# Altium schematic sheet Power_MCU.SchDoc
size A4; DocumentNumber: 3; SheetNumber: 3; SheetTotal: 8
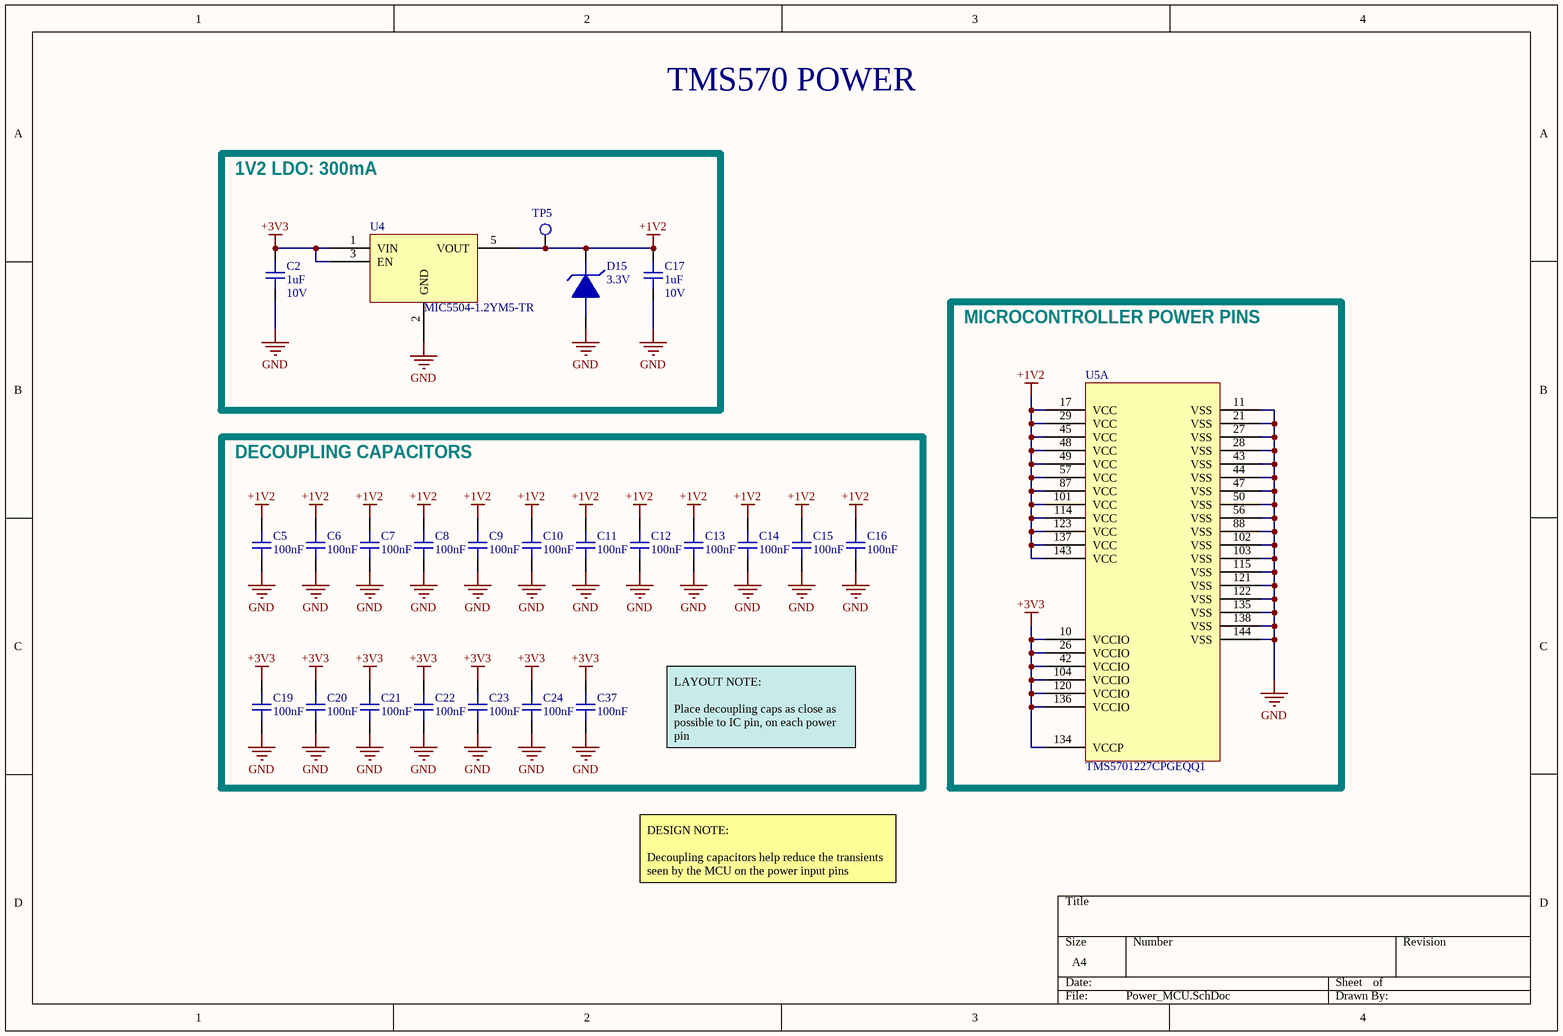
[diagram p0: Power_MCU.SchDoc]

## Parts
C2  1uF  Voltage Rating: 10V  [C0402]
C5  100nF  [C0402]
C6  100nF  [C0402]
C7  100nF  [C0402]
C8  100nF  [C0402]
C9  100nF  [C0402]
C10  100nF  [C0402]
C11  100nF  [C0402]
C12  100nF  [C0402]
C13  100nF  [C0402]
C14  100nF  [C0402]
C15  100nF  [C0402]
C16  100nF  [C0402]
C17  1uF  Voltage Rating: 10V  [C0402]
C19  100nF  [C0402]
C20  100nF  [C0402]
C21  100nF  [C0402]
C22  100nF  [C0402]
C23  100nF  [C0402]
C24  100nF  [C0402]
C37  100nF  [C0402]
D15  3.3V  [DIODE_TVS]
TP5  5015  [TP_HOOK]  (value not drawn)
U4  MIC5504-1.2YM5-TR  [SOT23-5-MIC5504]
U5  TMS5701227CPGEQQ1  [LQFP-144]  (part A of 3)

## Blocks framed on the sheet
1V2 LDO: 300mA: C2 C17 D15 TP5 U4
MICROCONTROLLER POWER PINS: U5
DECOUPLING CAPACITORS: C5-C16 C19-C24 C37

## Nets
+1V2: C5.2 C6.2 C7.2 C8.2 C9.2 C10.2 C11.2 C12.2 C13.2 C14.2 C15.2 C16.2 C17.2 D15.1 TP5.1 U4.5(VOUT) U5.17(VCC) U5.29(VCC) U5.45(VCC) U5.48(VCC) U5.49(VCC) U5.57(VCC) U5.87(VCC) U5.101(VCC) U5.114(VCC) U5.123(VCC) U5.137(VCC) U5.143(VCC)
+3V3: C2.2 C19.2 C20.2 C21.2 C22.2 C23.2 C24.2 C37.2 U4.1(VIN) U4.3(EN) U5.10(VCCIO) U5.26(VCCIO) U5.42(VCCIO) U5.104(VCCIO) U5.120(VCCIO) U5.134(VCCP) U5.136(VCCIO)
GND: C2.1 C5.1 C6.1 C7.1 C8.1 C9.1 C10.1 C11.1 C12.1 C13.1 C14.1 C15.1 C16.1 C17.1 C19.1 C20.1 C21.1 C22.1 C23.1 C24.1 C37.1 D15.2 U4.2(GND) U5.11(VSS) U5.21(VSS) U5.27(VSS) U5.28(VSS) U5.43(VSS) U5.44(VSS) U5.47(VSS) U5.50(VSS) U5.56(VSS) U5.88(VSS) U5.102(VSS) U5.103(VSS) U5.115(VSS) U5.121(VSS) U5.122(VSS) U5.135(VSS) U5.138(VSS) U5.144(VSS)

## Notes on the sheet
- TMS570 POWER
- LAYOUT NOTE:
  Place decoupling caps as close as possible to IC pin, on each power pin
- DESIGN NOTE:
  Decoupling capacitors help reduce the transients seen by the MCU on the power input pins

## Library data of the parts
C2 C17 = CL05A105MP5NNNC: CAP MLCC 1uF 10V 0402 X5R 20% SMD 0402 85C Paper T/R; Manufacturer: Samsung; Supplier 1: Digi-Key; Manufacturer Part Number: CL05A105MP5NNNC; Stock 1: 100000; Pricing 1: 1=0.1, 10=0.031, 100=0.014, 500=0.01, 1000=0.0079, 2500=0.0072, 5000=0.0066 (USD); Mount: Surface Mount; Case/Package: 0402; Case Code (Metric): 1005; Case Code (Imperial): 0402; Min Operating Temperature: -55°C; Max Operating Temperature: 85°C; Package Quantity: 1; Packaging: Tape and Reel; Capacitance: 1uF; Tolerance: 20%; Dielectric: X5R; Voltage Rating (DC): 10V; Length: 1mm; Height: 0.5mm; Width: 0.02inch; Thickness: 0.022inch; Depth: 0.5mm; Radiation Hardening: No; Lead Free: Lead Free; ComponentLink1URL: https://media.digikey.com/pdf/Data%20Sheets/Samsung%20PDFs/CL_Series_MLCC_ds.pdf; ComponentLink1Description: https://media.digikey.com/pdf/Data%20Sheets/Samsung%20PDFs/CL_Series_MLCC_ds.pdf; Supplier Part Number 1: 1276-1448-1-ND
C5-C16 C19-C24 C37 = CL05A104MP5NNNC: CAP MLCC 0.1uF 10V X5R 0402 20% SMD 0402 85C Paper T/R; Manufacturer: Samsung; Supplier 1: Digi-Key; Manufacturer Part Number: CL05A104MP5NNNC; Stock 1: 100000; Pricing 1: 1=0.1, 10=0.024, 100=0.0106, 500=0.0076, 1000=0.006, 2500=0.0054, 5000=0.005 (USD); Mount: Surface Mount; Case/Package: 0402; Case Code (Metric): 1005; Case Code (Imperial): 0402; Min Operating Temperature: -55°C; Max Operating Temperature: 85°C; Packaging: Tape and Reel; Capacitance: 100nF; Tolerance: 20%; Voltage Rating: 10V; Dielectric: X5R; Voltage Rating (DC): 10V; Length: 1mm; Height: 0.5mm; Width: 0.02inch; Thickness: 0.022inch; Depth: 0.5mm; Radiation Hardening: No; Lead Free: Lead Free; ComponentLink1URL: https://media.digikey.com/pdf/Data%20Sheets/Samsung%20PDFs/CL_Series_MLCC_ds.pdf; ComponentLink1Description: https://media.digikey.com/pdf/Data%20Sheets/Samsung%20PDFs/CL_Series_MLCC_ds.pdf; Supplier Part Number 1: 1276-1443-1-ND
D15 = 1SMA5913BT3G: DIODE ZENER 3.3V 1.5W SMA; Manufacturer: ON Semiconductor; Material: Plastic; Forward Voltage: 1.5V; Tolerance: 5%; Impedance: 10R; Max Reverse Leakage Current: 50uA; Power Dissipation: 500mW; Zener Current: 455mA; Test Current: 113.6mA; Element Configuration: Single; Breakdown Voltage: 3.47V; Supplier 1: Digi-Key; Manufacturer Part Number: 1SMA5913BT3G; Stock 1: 12228; Pricing 1: 1=0.38, 10=0.305, 100=0.2076, 500=0.1557, 1000=0.1168 (USD); Case/Package: SMA; Number of Pins: 2; Min Operating Temperature: -65°C; Max Operating Temperature: 150°C; Max Power Dissipation: 1.5W; Package Quantity: 1; Packaging: Tape and Reel; Zener Voltage: 3.3V; Voltage Tolerance: 5%; Working Voltage: 3.3V; Peak Reverse Current: 50uA; Voltage Rating (DC): 3.3V; Power Rating: 1.5W; Length: 4.57mm; Height: 2.05mm; Width: 2.92mm; Radiation Hardening: No; REACH SVHC: No SVHC; Lead Free: Lead Free; Halogen Free: Halogen Free; ComponentLink1URL: https://datasheet.ciiva.com/8026/1sma5913bt3-d-8026917.pdf; ComponentLink1Description: https://datasheet.ciiva.com/8026/1sma5913bt3-d-8026917.pdf; ComponentLink2URL: https://datasheet.ciiva.com/8345/1sma5913bt3-d-8345864.pdf; ComponentLink2Description: https://datasheet.ciiva.com/8345/1sma5913bt3-d-8345864.pdf; ComponentLink3URL: https://datasheet.ciiva.com/8346/1sma5913bt3-d-8346488.pdf; ComponentLink3Description: https://datasheet.ciiva.com/8346/1sma5913bt3-d-8346488.pdf; ComponentLink4URL: https://datasheet.ciiva.com/895/1sma5913bt3-d-895306.pdf; ComponentLink4Description: https://datasheet.ciiva.com/895/1sma5913bt3-d-895306.pdf; ComponentLink5URL: https://datasheet.ciiva.com/15142/getdatasheetpartid-90498-15142554.pdf; ComponentLink5Description: https://datasheet.ciiva.com/15142/getdatasheetpartid-90498-15142554.pdf; ComponentLink6URL: https://datasheet.ciiva.com/895/1sma5913bt3-d-895307.pdf; ComponentLink6Description: https://datasheet.ciiva.com/895/1sma5913bt3-d-895307.pdf; ComponentLink7URL: https://datasheet.ciiva.com/4733/1sma5913bt3-d-4733195.pdf; ComponentLink7Description: https://datasheet.ciiva.com/4733/1sma5913bt3-d-4733195.pdf; ComponentLink8URL: https://datasheet.ciiva.com/895/1sma5913bt3-d-895308.pdf; ComponentLink8Description: https://datasheet.ciiva.com/895/1sma5913bt3-d-895308.pdf; ComponentLink9URL: https://datasheet.ciiva.com/16472/1sma5913bt3-d-16472764.pdf; ComponentLink9Description: https://datasheet.ciiva.com/16472/1sma5913bt3-d-16472764.pdf; ComponentLink10URL: https://datasheet.ciiva.com/49027/70339279-49027772.pdf; ComponentLink10Description: https://datasheet.ciiva.com/49027/70339279-49027772.pdf; ComponentLink11URL: https://datasheet.ciiva.com/8026/1sma5913bt3-d-8026989.pdf; ComponentLink11Description: https://datasheet.ciiva.com/8026/1sma5913bt3-d-8026989.pdf; ComponentLink12URL: https://datasheet.ciiva.com/8026/1sma5913bt3-d-8026990.pdf; ComponentLink12Description: https://datasheet.ciiva.com/8026/1sma5913bt3-d-8026990.pdf; ComponentLink13URL: https://datasheet.ciiva.com/26092/1sma5913bt3-d-26092398.pdf; ComponentLink13Description: https://datasheet.ciiva.com/26092/1sma5913bt3-d-26092398.pdf; Supplier Part Number 1: 1SMA5913BT3GOSCT-ND
TP5 = 5015: TEST POINT, PCB, SMT; Manufacturer: Keystone Electronics; Number of Ports: 1; Supplier 1: Digi-Key; Manufacturer Part Number: 5015; Stock 1: 1937775; Pricing 1: 1=0.44, 10=0.421, 25=0.3604, 50=0.3064, 100=0.2944, 250=0.2644, 500=0.2524 (USD); Mount: Surface Mount; Colour: White; Contact Material: Bronze; Contact Plating: Tin,Silver,Lead; Material: Bronze,Silver; Package Quantity: 1; Packaging: Tape and Reel; Termination: Solder; Orientation: Straight; Length: 2.66mm; Height: 0.06inch; Thickness: 0.01inch; Depth: 1.01mm; REACH SVHC: No SVHC; Lead Free: Lead Free; ComponentLink1URL: https://datasheet.ciiva.com/2917/5015-2917616.pdf; ComponentLink1Description: https://datasheet.ciiva.com/2917/5015-2917616.pdf; ComponentLink2URL: https://datasheet.ciiva.com/2917/5015-2917617.pdf; ComponentLink2Description: https://datasheet.ciiva.com/2917/5015-2917617.pdf; ComponentLink3URL: https://datasheet.ciiva.com/1123/5015-1123862.pdf; ComponentLink3Description: https://datasheet.ciiva.com/1123/5015-1123862.pdf; ComponentLink4URL: https://datasheet.ciiva.com/16883/70182998-16883734.pdf; ComponentLink4Description: https://datasheet.ciiva.com/16883/70182998-16883734.pdf; Supplier Part Number 1: 36-5015CT-ND
U4 = MIC5504-1.2YM5-TR: IC LDO 1.2V 300mA Enable Pull-Down & Auto Discharge, 5 SOT-23 T/R; Manufacturer: Microchip; Dropout Voltage: 160mV; Number of Regulators: 1; Min Current Limit: 400mA; Supplier 1: Digi-Key; Manufacturer Part Number: MIC5504-1.2YM5-TR; Stock 1: 479; Pricing 1: 1=0.11, 25=0.0928, 100=0.0824 (USD); Mount: Surface Mount; Case/Package: SOT-23-5; Min Operating Temperature: -40°C; Max Operating Temperature: 125°C; Packaging: Cut Tape; Output Voltage: 1.2V; Output Current: 300mA; Supplier Part Number 1: 576-4878-1-ND
U5 = TMS5701227CPGEQQ1: IC MCU 16-Bit/32-Bit Hercules TMS570 ARM Cortex R4F RISC 1280KB Flash 1.2V/3.3V 144-Pin LQFP; Manufacturer: Texas Instruments; Frequency: 160MHz; Interface: CAN,EBI/EMI,Ethernet,I2C,LIN,SCI,SPI,UART,USART; Number of I/Os: 58; Oscillator Type: External; RAM Size: 192KB; Number of Timers/Counters: 2; Watchdog Timer: Yes; Memory Size: 1.25MB; Density: 1310720B; Peripherals: DMA,POR,PWM,WDT; Supplier 1: Digi-Key; Manufacturer Part Number: TMS5701227CPGEQQ1; Stock 1: 2872; Pricing 1: 1=24.99, 10=23.046, 60=22.0098, 120=19.6794, 540=17.8669 (USD); Case/Package: LQFP; Number of Pins: 144; Min Operating Temperature: -40°C; Max Operating Temperature: 125°C; Packaging: Tray; Number of Programmable I/O: 58; Max Frequency: 160MHz; Memory Type: FLASH; Number of GPIO: 58; Core Architecture: ARM; Lead Free: Lead Free; Supplier Part Number 1: 296-42451-ND